# Altium schematic sheet 7V4输出1.SchDoc
size A4
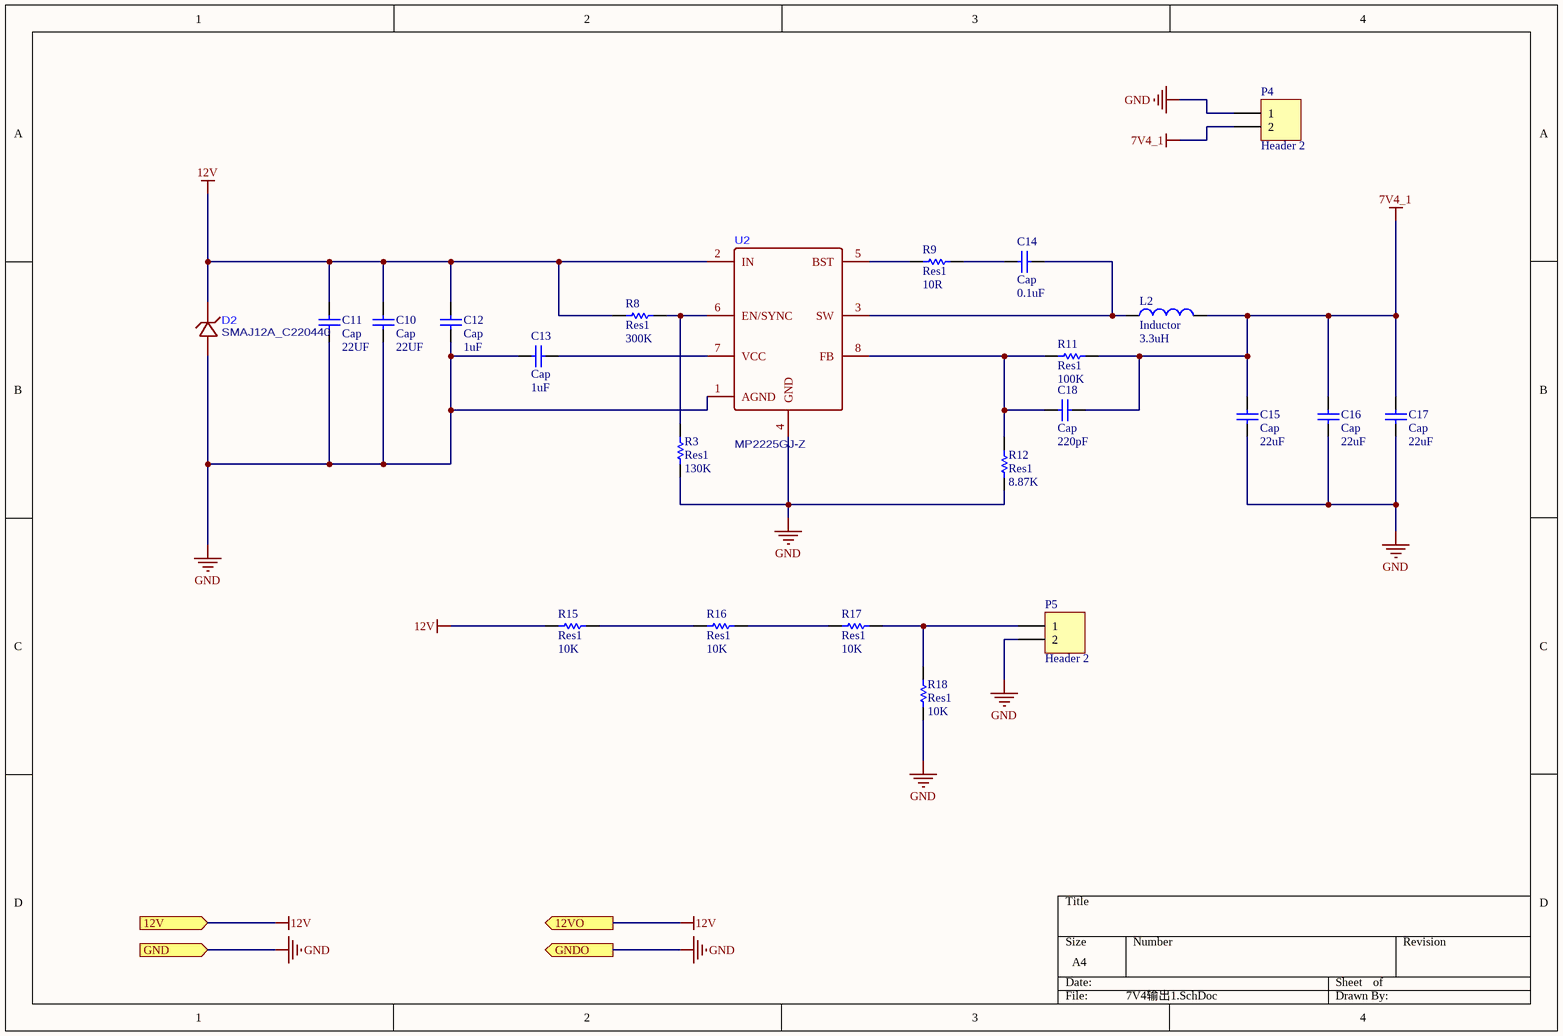
[diagram p0: 7V4输出1.SchDoc]

## Parts
C10  Cap  value 22UF  [C1206]
C11  Cap  value 22UF  [C1206]
C12  Cap  value 1uF  [R0603]
C13  Cap  value 1uF  [R0603]
C14  Cap  value 0.1uF  [R0603]
C15  Cap  value 22uF  [C0805]
C16  Cap  value 22uF  [C0805]
C17  Cap  value 22uF  [C0805]
C18  Cap  value 220pF  [R0603]
D2  SMAJ12A_C220440  [SMA_L4.4-W2.8-LS5.4-RD]
L2  Inductor  value 3.3uH  [IND-SMD_L7.8-W7.0_MAPM0630F]
P4  Header 2  [XH2.54-2A]
P5  Header 2  [XH2.54-2A]
R3  Res1  value 130K  [R0603]
R8  Res1  value 300K  [R0603]
R9  Res1  value 10R  [R0603]
R11  Res1  value 100K  [R0603]
R12  Res1  value 8.87K  [R0603]
R15  Res1  value 10K  [R0603]
R16  Res1  value 10K  [R0603]
R17  Res1  value 10K  [R0603]
R18  Res1  value 10K  [R0603]
U2  MP2225GJ-Z  [TSOT-23-8_L2.9-W1.6-P0.65-LS2.8-BR]

## Ports
12V (in), 12VO (out), GND (in), GNDO (out)

## Nets
7V4_1: C15.2 C16.2 C17.2 C18.2 L2.2 P4.2 R11.2
12V: C10.2 C11.2 C12.2 D2.1 R8.1 R15.2 U2.2(IN) ; port 12V, port 12VO
GND: C10.1 C11.1 C12.1 C13.1 C15.1 C16.1 C17.1 D2.2 P4.1 P5.2 R3.1 R12.1 R18.1 U2.1(AGND) U2.4(GND) ; port GND, port GNDO
NetC13_2: C13.2 U2.7(VCC)
NetC14_1: C14.1 R9.2
NetC14_2: C14.2 L2.1 U2.3(SW)
NetC18_1: C18.1 R11.1 R12.2 U2.8(FB)
NetP5_1: P5.1 R17.1 R18.2
NetR3_2: R3.2 R8.2 U2.6(EN/SYNC)
NetR9_1: R9.1 U2.5(BST)
NetR15_1: R15.1 R16.2
NetR16_1: R16.1 R17.2

## Library data of the parts
C10-C18 = Cap: Capacitor; Published: 8-Jun-2000; LatestRevisionDate: 17-Jul-2002; LatestRevisionNote: Re-released for DXP Platform.; PackageReference: RAD-0.3; Publisher: Altium Limited; PackageDescription: Radial Cap, Thru-Hole; 2 Leads; 0.3 in Pin Spacing
L2 = Inductor: Code_IEC: 1005; Published: 8-Jun-2000; LatestRevisionDate: 29-May-2009; LatestRevisionNote: IPC-7351 Footprint Added.; PackageReference: 0402-A; Publisher: Altium Limited; PackageDescription: Chip Inductor; Code_JEITA: 0402
P4 P5 = Header 2: Header, 2-Pin; LatestRevisionDate: 17-Jul-2002; LatestRevisionNote: Re-released for DXP Platform.; Publisher: Altium Limited
R3 R8 R9 R11 R12 R15-R18 = Res1: Resistor; Published: 8-Jun-2000; LatestRevisionDate: 17-Jul-2002; LatestRevisionNote: Re-released for DXP Platform.; PackageReference: AXIAL-0.3; Publisher: Altium Limited; PackageDescription: Axial Device, Thru-Hole; 2 Leads; 0.3 in Pin Spacing